# EAGLE design cube (EAGLE 6.2)
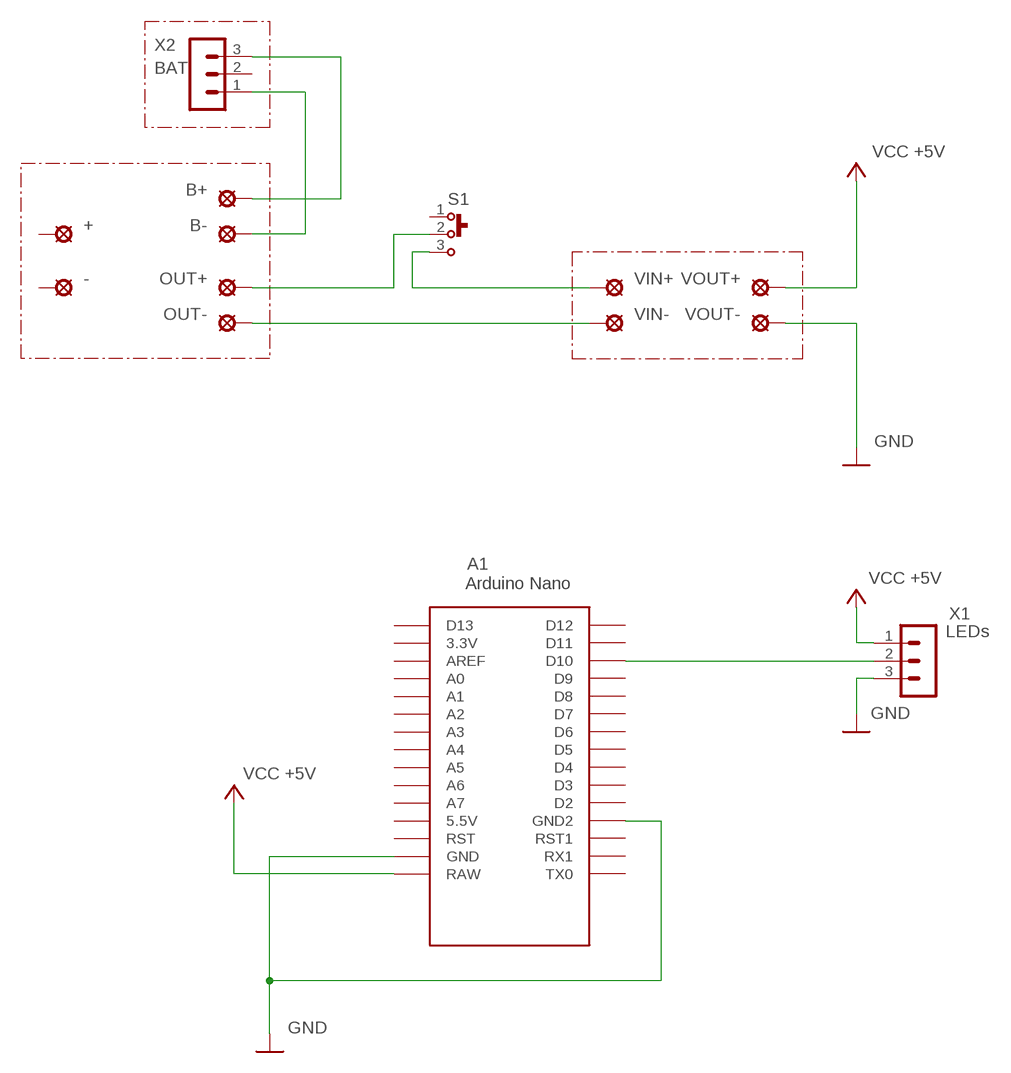
[diagram p0: schematic, sheet 1]

## Parts
+  MCS08  [MCS08]
-  MCS08  [MCS08]
A1  NANO  [NANO]
B+  MCS08  [MCS08]
B-  MCS08  [MCS08]
OUT+  MCS08  [MCS08]
OUT-  MCS08  [MCS08]
S1  EG1218  [EG1218]
VIN+  MCS08  [MCS08]
VIN-  MCS08  [MCS08]
VOUT+  MCS08  [MCS08]
VOUT-  MCS08  [MCS08]
X1  LEDs  MA03-1  [MA03-1]
X2  BAT  MA03-1  [MA03-1]

## Nets
GND: A1.GND A1.GND1(GND2) VOUT-.MP X1.3
N$1: OUT+.MP S1.2
N$2: OUT-.MP VIN-.MP
N$3: S1.3 VIN+.MP
N$7: B-.MP X2.1
N$9: B+.MP X2.3
N$12: A1.D10 X1.2
VCC: A1.RAW VOUT+.MP X1.1 ; supply symbol labelled VCC +5V
Unconnected: +.MP -.MP A1.3.3V A1.5V(5.5V) A1.A0 A1.A1 A1.A2 A1.A3 A1.A4 A1.A5 A1.A6 A1.A7 A1.AREF A1.D2 A1.D3 A1.D4 A1.D5 A1.D6 A1.D7 A1.D8 A1.D9 A1.D11 A1.D12 A1.D13 A1.RST A1.RST1 A1.RX1 A1.TX0 S1.1 X2.2

## Notes on the sheet
- A1

## Library data of the parts
+ - B+ B- OUT+ OUT- VIN+ VIN- VOUT+ VOUT- = solpad:MCS08: SOLDER PAD MC S0,8, drill 1.2 mm, distributor Buerklin, 08F130
A1 = Arduino-clone:NANO: Arduino Nano
S1 = switch-e-switch:EG1218: SLIDE SWITCH
X1 X2 = con-lstb:MA03-1: PIN HEADER; OC_FARNELL: unknown; OC_NEWARK: unknown

## Board
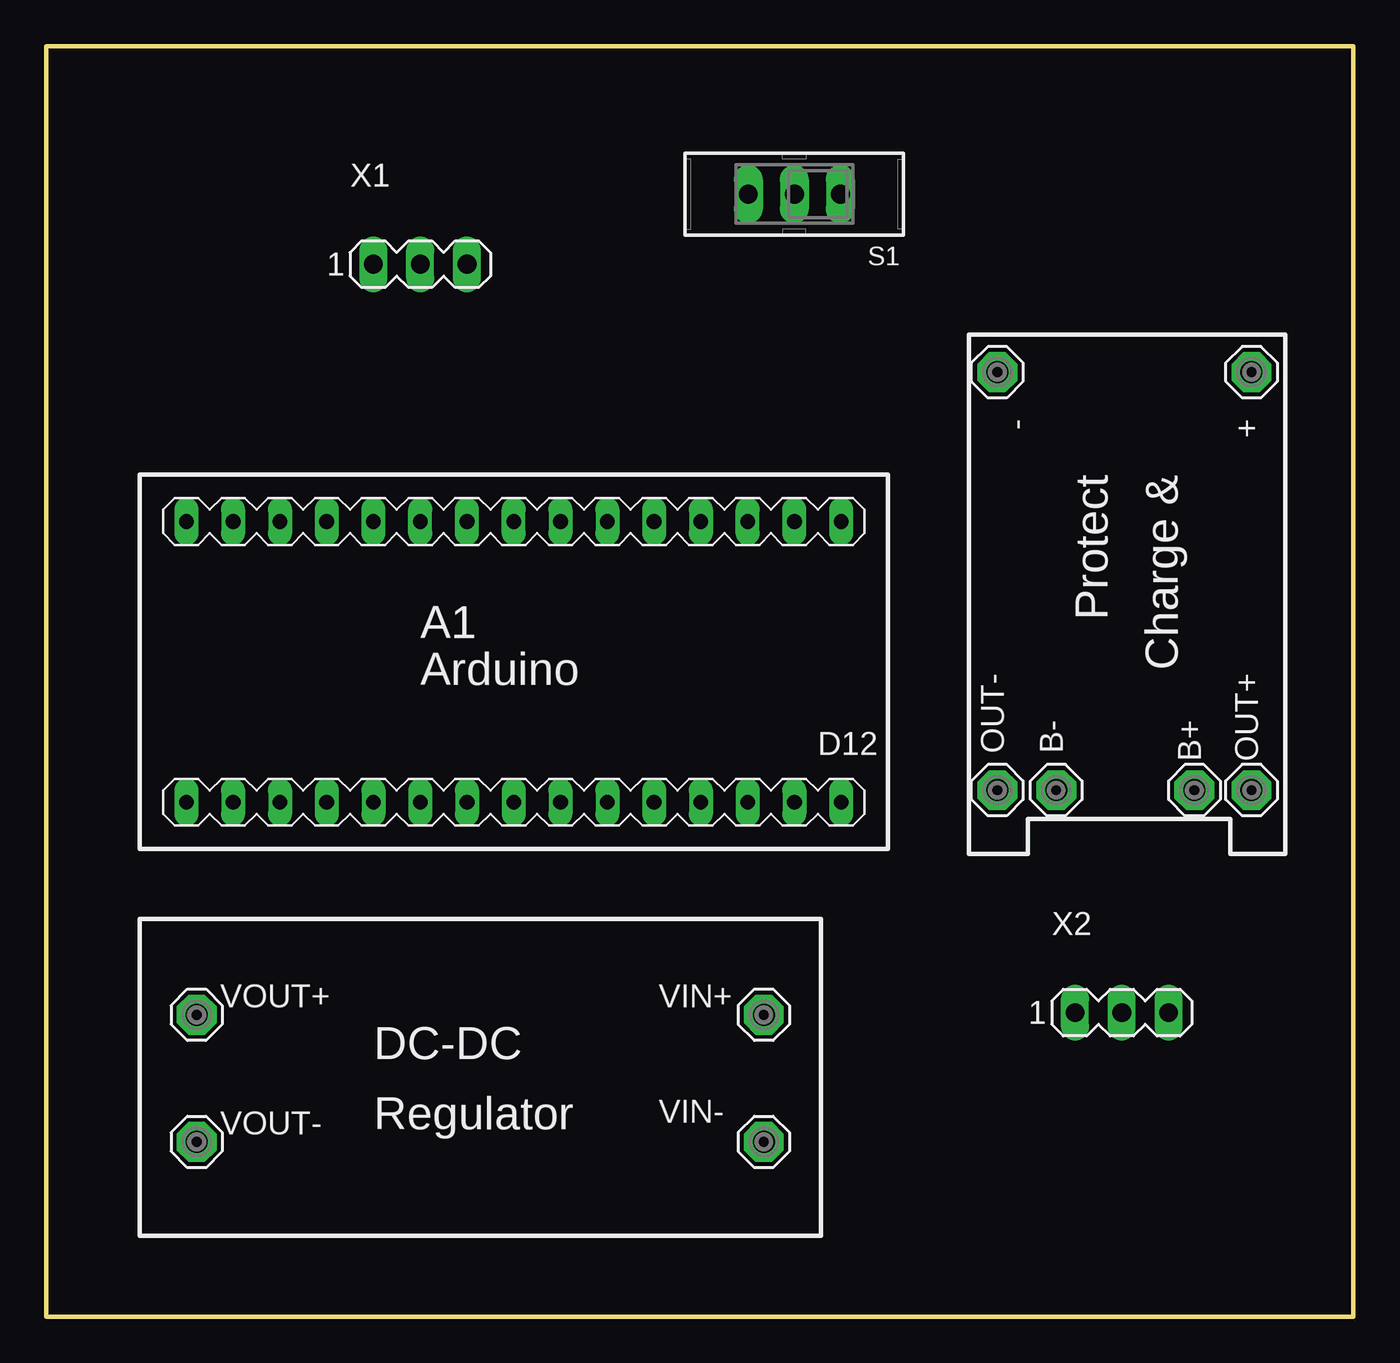
[diagram p1: board, top side]
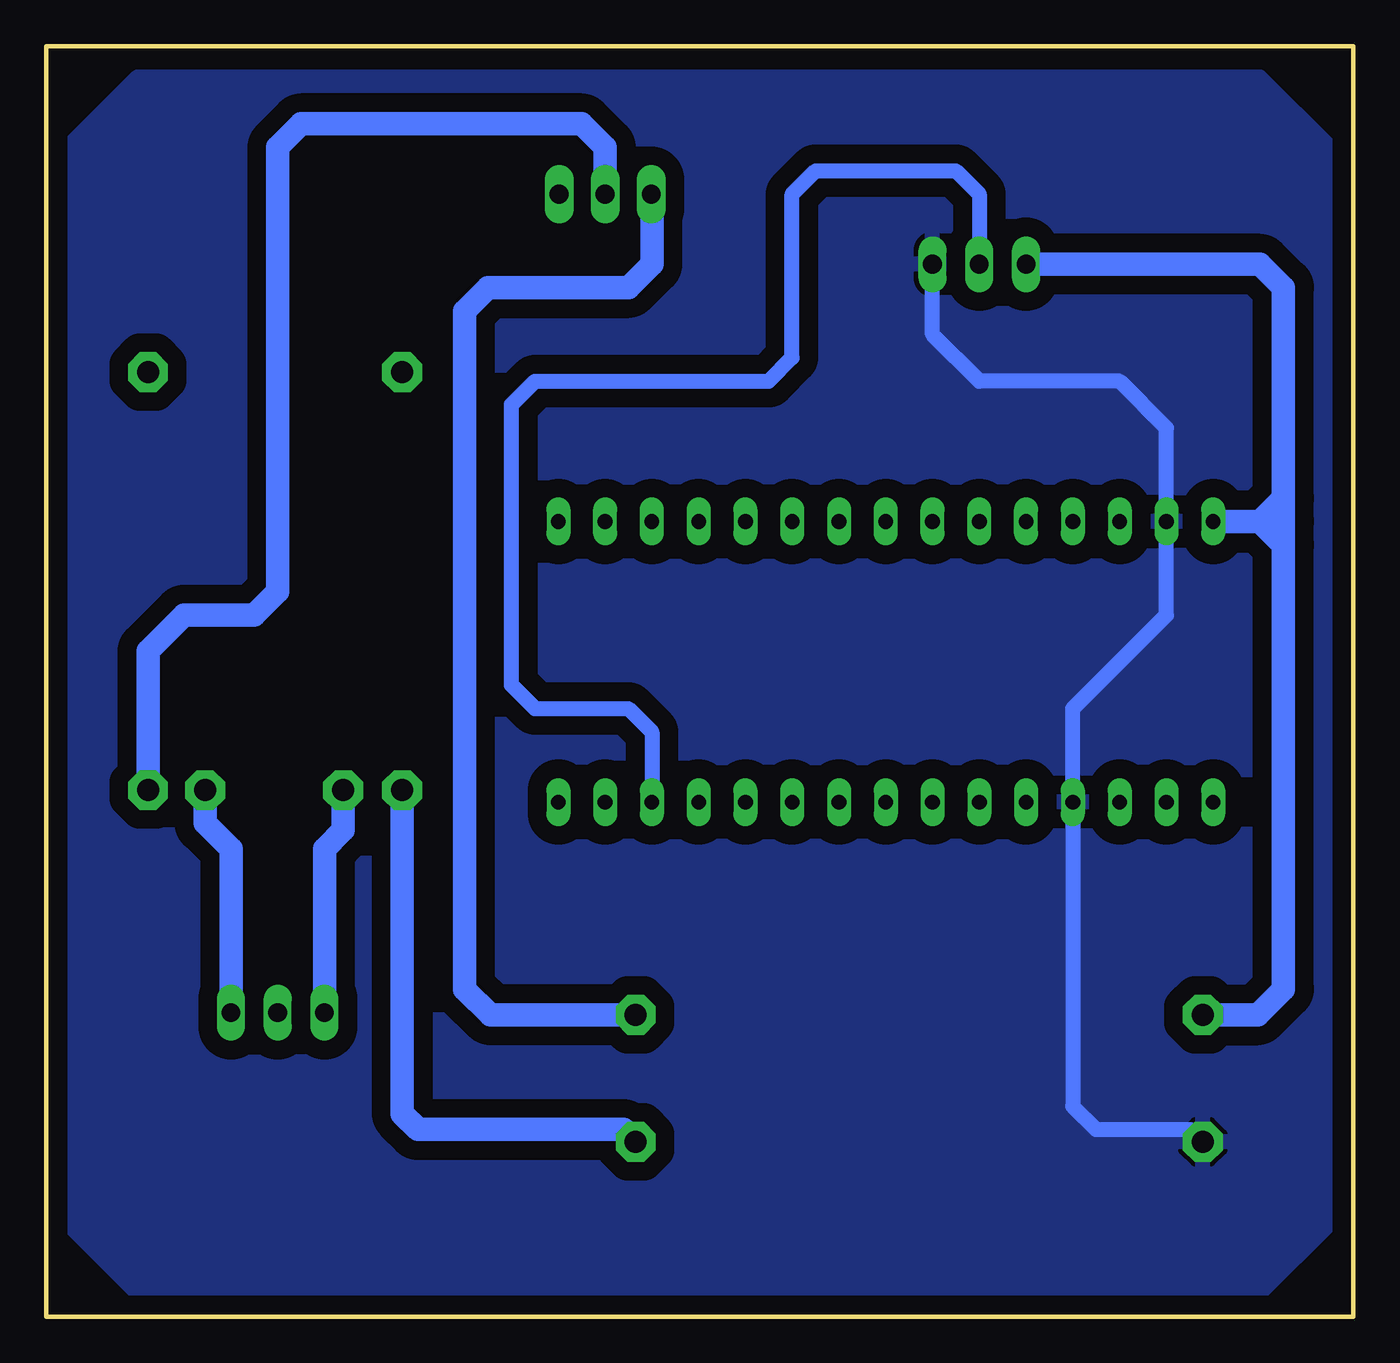
[diagram p2: board, bottom side, seen from below]

Size 71 x 69 mm. Coordinates in mm from the lower left corner, seen from the top.
Outline: 0,0 71,0 71,69 0,69 0,0
Copper layers (1*16): Top 0.035mm / dielectric 1.5mm / Bottom 0.035mm
Design rules: minimum track width 10mil, minimum drill 24mil, track to track 8mil, track to pad 8mil, pad to pad 8mil, via to via 8mil, smd to smd 8mil, copper to edge 40mil, drill to drill 8mil, minimum pad ring 10mil, minimum via ring 8mil, stop-mask expansion 4mil, vias tented up to drill 0mil, thermal gap 10mil

### Footprints (pad centres in the part's own frame; a part is rotated, then mirrored left to right if it is on the bottom)
MCS08 = drill 1.194 pad 2.159 octagon: MP 0,0
NANO = drill 0.8 long: 3.3V -10.16,24.13; 5V -10.16,-1.27; A0 -10.16,19.05; A1 -10.16,16.51; A2 -10.16,13.97; A3 -10.16,11.43; A4 -10.16,8.89; A5 -10.16,6.35; A6 -10.16,3.81; A7 -10.16,1.27; AREF -10.16,21.59; D2 5.08,1.27; D3 5.08,3.81; D4 5.08,6.35; D5 5.08,8.89; D6 5.08,11.43; D7 5.08,13.97; D8 5.08,16.51; D9 5.08,19.05; D10 5.08,21.59; D11 5.08,24.13; D12 5.08,26.67; D13 -10.16,26.67; GND -10.16,-6.35; GND1 5.08,-1.27; RAW -10.16,-8.89; RST -10.16,-3.81; RST1 5.08,-3.81; RX1 5.08,-6.35; TX0 5.08,-8.89
EG1218 = drill 1.016 pad 1.587 long: 1 -2.5,0; 2 0,0; 3 2.5,0
MA03-1 = drill 1.016 long: 1 -2.54,0; 2 0,0; 3 2.54,0

### Placement (x,y rotation side)
+  65.46,51.29 270 top
-  51.66,51.29 270 top
A1  16.51,33.02 270 top
B+  62.36,28.59 270 top
B-  54.86,28.59 270 top
OUT+  65.46,28.59 270 top
OUT-  51.66,28.59 270 top
S1  40.64,60.96 180 top
VIN+  38.98,16.39 0 top
VIN-  38.98,9.49 0 top
VOUT+  8.18,16.39 0 top
VOUT-  8.18,9.49 0 top
X1  20.32,57.15 0 top
X2  58.42,16.51 0 top

### Tracks (layer width: path | path; a pad name or v marks a point on that pad's centre or on a via)
GND
  Bottom 0.813: VOUT-.MP 8.85,10.16 13.97,10.16 15.24,11.43 A1.GND1 15.24,33.02 10.16,38.1 A1.GND 10.16,48.26 12.7,50.8 20.32,50.8 22.86,53.34 X1.3
  pour Bottom (isolate 1.016): 1.27,63.5 5.08,67.31 66.04,67.31 69.85,63.5 69.85,5.08 66.04,1.27 5.08,1.27 1.27,5.08
N$1
  Bottom 1.27: S1.2 40.64,63.5 41.91,64.77 57.15,64.77 58.42,63.5 58.42,39.37 59.69,38.1 63.5,38.1 65.46,36.14 OUT+.MP
N$2
  Bottom 1.27: OUT-.MP 51.66,11.02 50.8,10.16 39.65,10.16 VIN-.MP
N$3
  Bottom 1.27: VIN+.MP 46.87,16.39 48.26,17.78 48.26,54.61 46.99,55.88 39.37,55.88 38.1,57.15 38.1,60.92 S1.3
N$7
  Bottom 1.27: B-.MP 54.86,26.42 55.88,25.4 X2.1
N$9
  Bottom 1.27: B+.MP 62.36,26.8 60.96,25.4 X2.3
N$12
  Bottom 0.813: A1.D10 38.1,31.75 39.37,33.02 44.45,33.02 45.72,34.29 45.72,49.53 44.45,50.8 31.75,50.8 30.48,52.07 30.48,60.96 29.21,62.23 21.59,62.23 20.32,60.96 X1.2
VCC
  Bottom 0.813: 5.08,43.18 3.81,43.18
  Bottom 1.27: VOUT+.MP 5.2,16.39 3.81,17.78 3.81,41.91 | 3.81,41.91 3.81,43.18 3.81,44.45 | 3.81,44.45 3.81,55.88 5.08,57.15 X1.1 | A1.RAW 5.08,43.18 | 3.81,41.91 5.08,43.18 | 5.08,43.18 3.81,44.45

### Text on the board
tPlace: Protect | Charge & | A1 | Arduino | D12 | DC-DC | Regulator